# Altium schematic sheet Connector.SchDoc
size A3
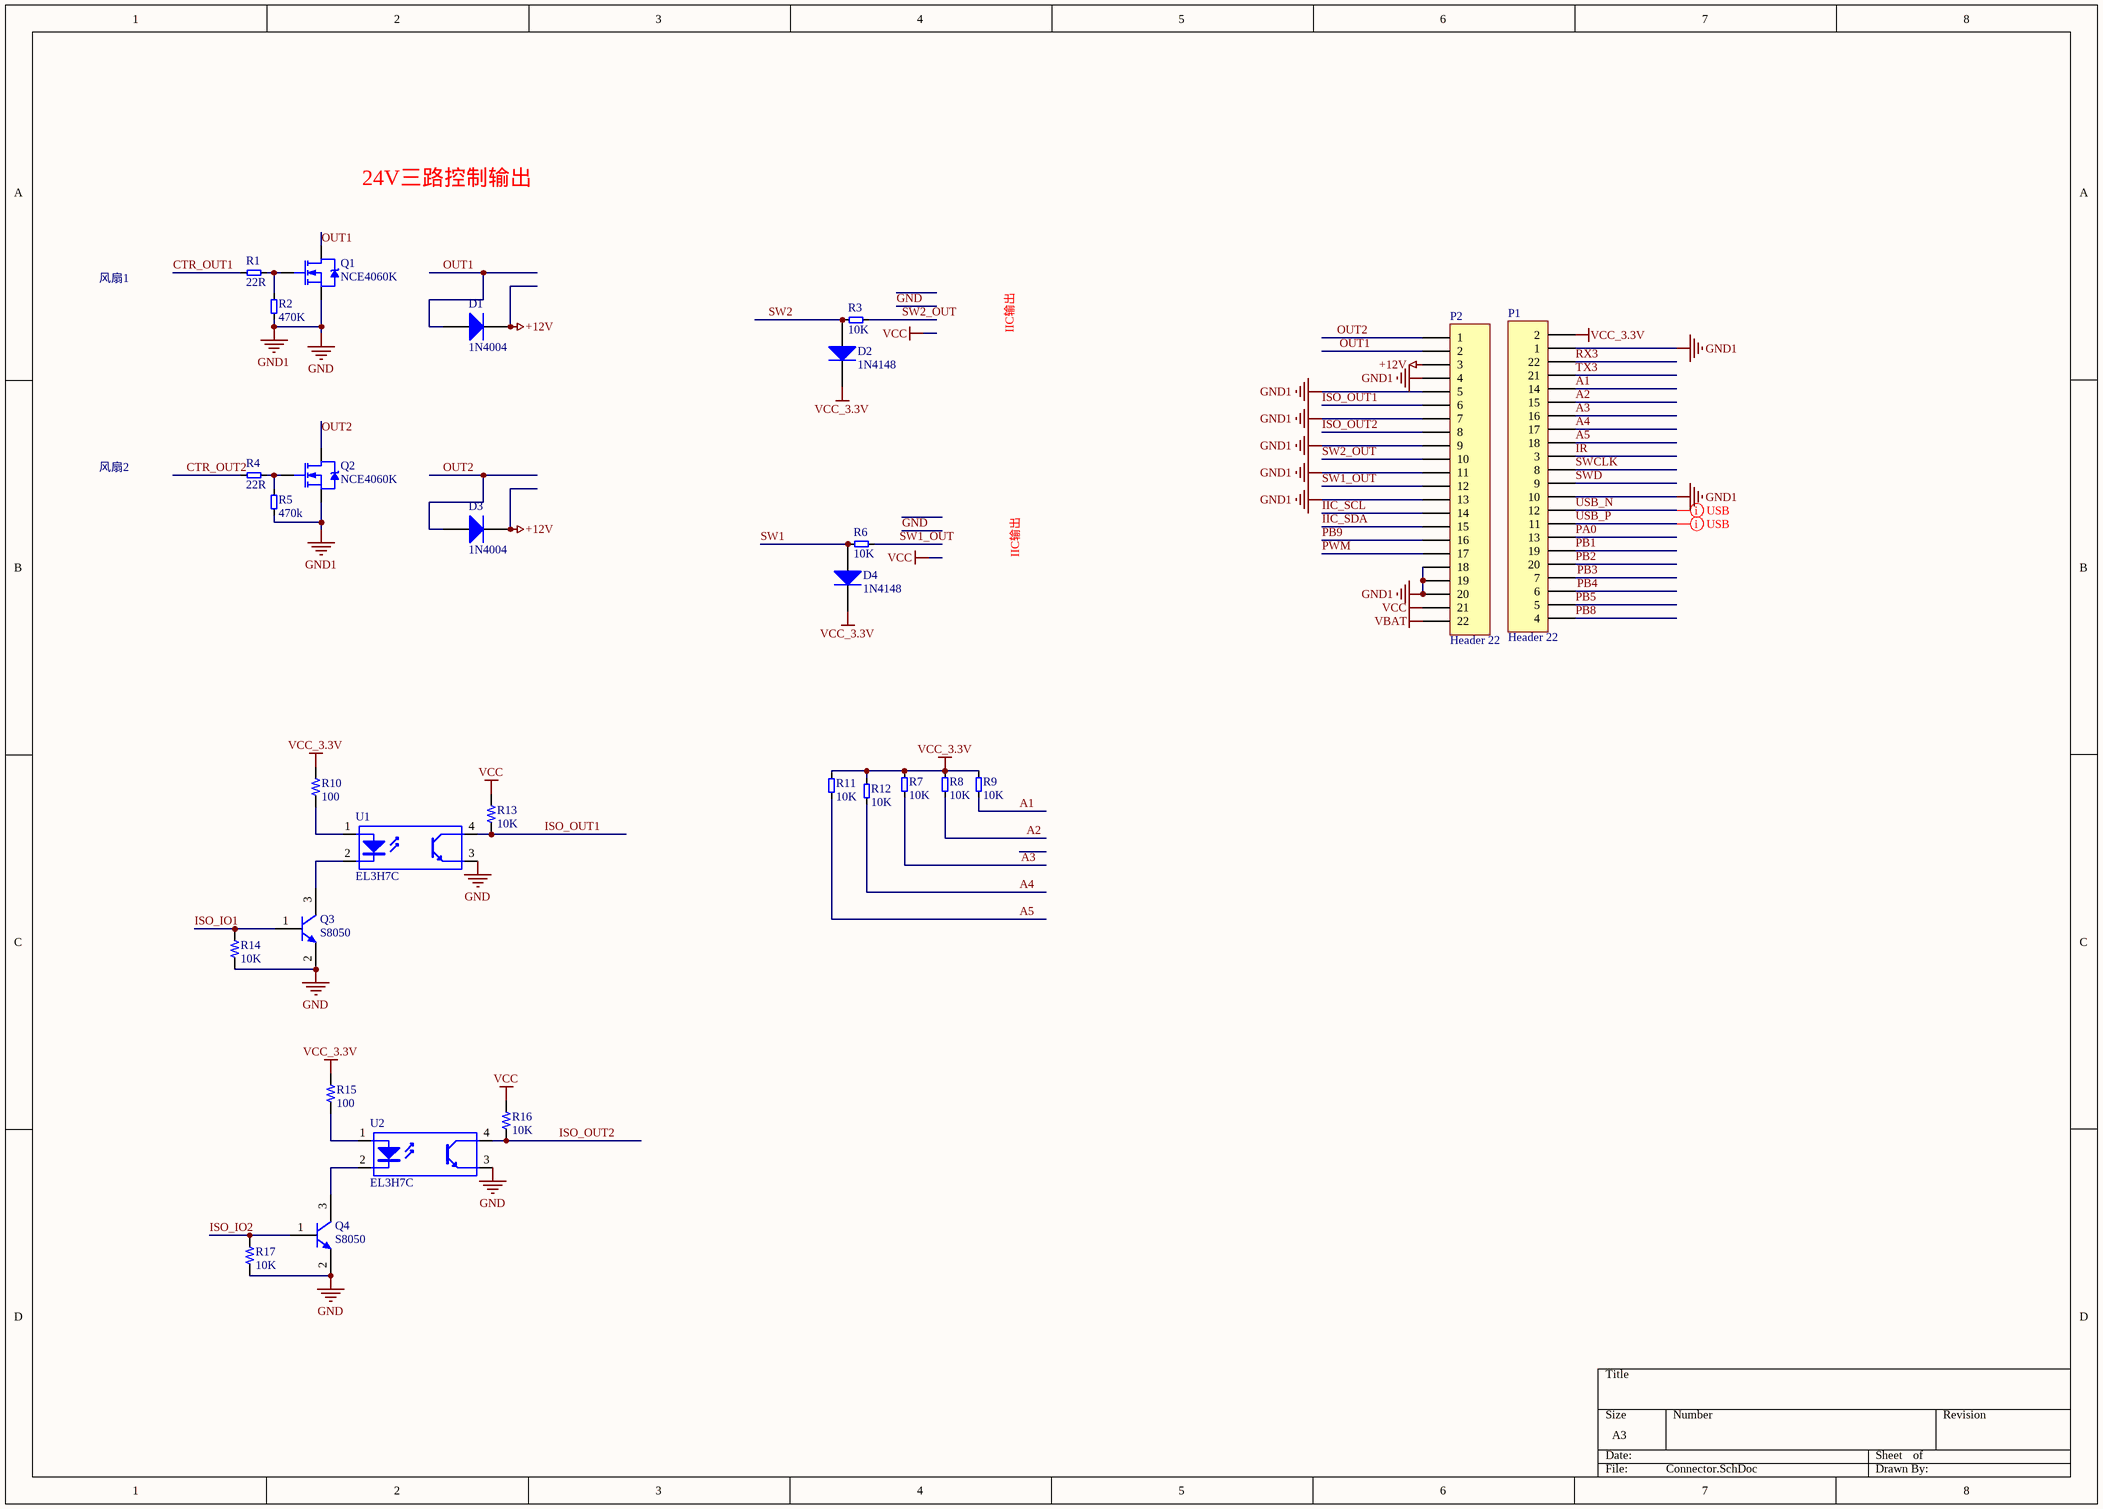
[diagram p0: Connector.SchDoc]

## Parts
D1  1N4004  [SMA]
D2  1N4148  [sod323]
D3  1N4004  [SMA]
D4  1N4148  [sod323]
P1  Header 22  [pcb_module_a]
P2  Header 22  [pcb_module_a]
Q1  NCE4060K  [TO-252-3S]
Q2  NCE4060K  [TO-252-3S]
Q3  S8050  [SOT23-3]
Q4  S8050  [SOT23-3]
R1  22R  [0402R]
R2  470K  [0402R]
R3  10K  [0402R]
R4  22R  [0402R]
R5  470k  [0402R]
R6  10K  [0402R]
R7  10K  [0402R]
R8  10K  [0402R]
R9  10K  [0402R]
R10  100  [0402R]
R11  10K  [0402R]
R12  10K  [0402R]
R13  10K  [0402R]
R14  10K  [0402R]
R15  100  [0402R]
R16  10K  [0402R]
R17  10K  [0402R]
U1  EL3H7C  [EL3H7C]
U2  EL3H7C  [EL3H7C]

## Nets
+12V: D1.2(K) D3.2(K) P2.3
GND: P1.1 P1.10 P2.4 P2.5 P2.7 P2.9 P2.11 P2.13 P2.18 P2.19 P2.20 Q1.3(S) Q2.3(S) Q3.2(E) Q4.2(E) R2.1 R5.1 R14.1 R17.1 U1.3(E) U2.3(E)  [also labelled GND1]
VBAT: P2.22
VCC: P2.21 R13.2 R16.2
VCC_3.3V: D2.K D4.K P1.2 R7.2 R8.2 R9.2 R10.2 R11.2 R12.1 R15.2
A1: P1.14 R9.1
A2: P1.15 R8.1
A3: P1.16 R7.1
A4: P1.17 R12.2
A5: P1.18 R11.1
CTR_OUT1: R1.1
CTR_OUT2: R4.1
IIC_SCL: P2.14
IIC_SDA: P2.15
IR: P1.3
ISO_IO1: Q3.1(B) R14.2
ISO_IO2: Q4.1(B) R17.2
ISO_OUT1: P2.6 R13.1 U1.4(C)
ISO_OUT2: P2.8 R16.1 U2.4(C)
OUT1: D1.1(A) P2.2 Q1.2(D)
OUT2: D3.1(A) P2.1 Q2.2(D)
PA0: P1.13
PB1: P1.19
PB2: P1.20
PB3: P1.7
PB4: P1.6
PB5: P1.5
PB8: P1.4
PB9: P2.16
PWM: P2.17
RX3: P1.22
SW1: D4.A R6.2
SW1_OUT: P2.12 R6.1
SW2: D2.A R3.2
SW2_OUT: P2.10 R3.1
SWCLK: P1.8
SWD: P1.9
TX3: P1.21
USB_N: P1.12
USB_P: P1.11
NetQ1_1: Q1.1(G) R1.2 R2.2
NetQ2_1: Q2.1(G) R4.2 R5.2
NetQ3_3: Q3.3(C) U1.2(K)
NetQ4_3: Q4.3(C) U2.2(K)
NetR10_1: R10.1 U1.1(A)
NetR15_1: R15.1 U2.1(A)

## Layout directives
differential pair: USB_N, USB_P

## Notes on the sheet
- 24V三路控制输出
- 风扇1
- IIC输出
- 风扇2

## Library data of the parts
D1 D3 = Diode_2: Default Diode; Published: 8-Jun-2000; LatestRevisionDate: 17-Jul-2002; LatestRevisionNote: Re-released for DXP Platform.; PackageVersion: Sep-1996; PackageReference: SMC; Publisher: Altium Limited; PackageDescription: DO-214-AB/SMC; 2 C-Bend Leads; Body 7.9 x 5.9 mm, inc. leads (LxW); Code_JEDEC: DO-214-AB
D2 D4 = Diode: Default Diode; Published: 8-Jun-2000; LatestRevisionDate: 17-Jul-2002; LatestRevisionNote: Re-released for DXP Platform.; PackageVersion: Sep-1996; PackageReference: SMC; Publisher: Altium Limited; Code_JEDEC: DO-214-AB
P1 P2 = Header 22: Header, 22-Pin; LatestRevisionDate: 17-Jul-2002; LatestRevisionNote: Re-released for DXP Platform.; Publisher: Altium Limited
Q1 Q2 = NCE4060K: NMOSFET
Q3 Q4 = NPN
R1-R9 R11 R12 = 1K: CR85-102J
R10 R13-R17 = R
U1 U2 = Optoisolator1: 4-Pin Phototransistor Optocoupler; Published: 24-Mar-1999; LatestRevisionDate: 04-Mar-2005; LatestRevisionNote: Sch pins 3 & 4 Swapped.; DatasheetVersion: Nov-2003; PackageReference: DIP-4; Publisher: Altium Limited